# Altium project PCB_HAT.PrjPcb
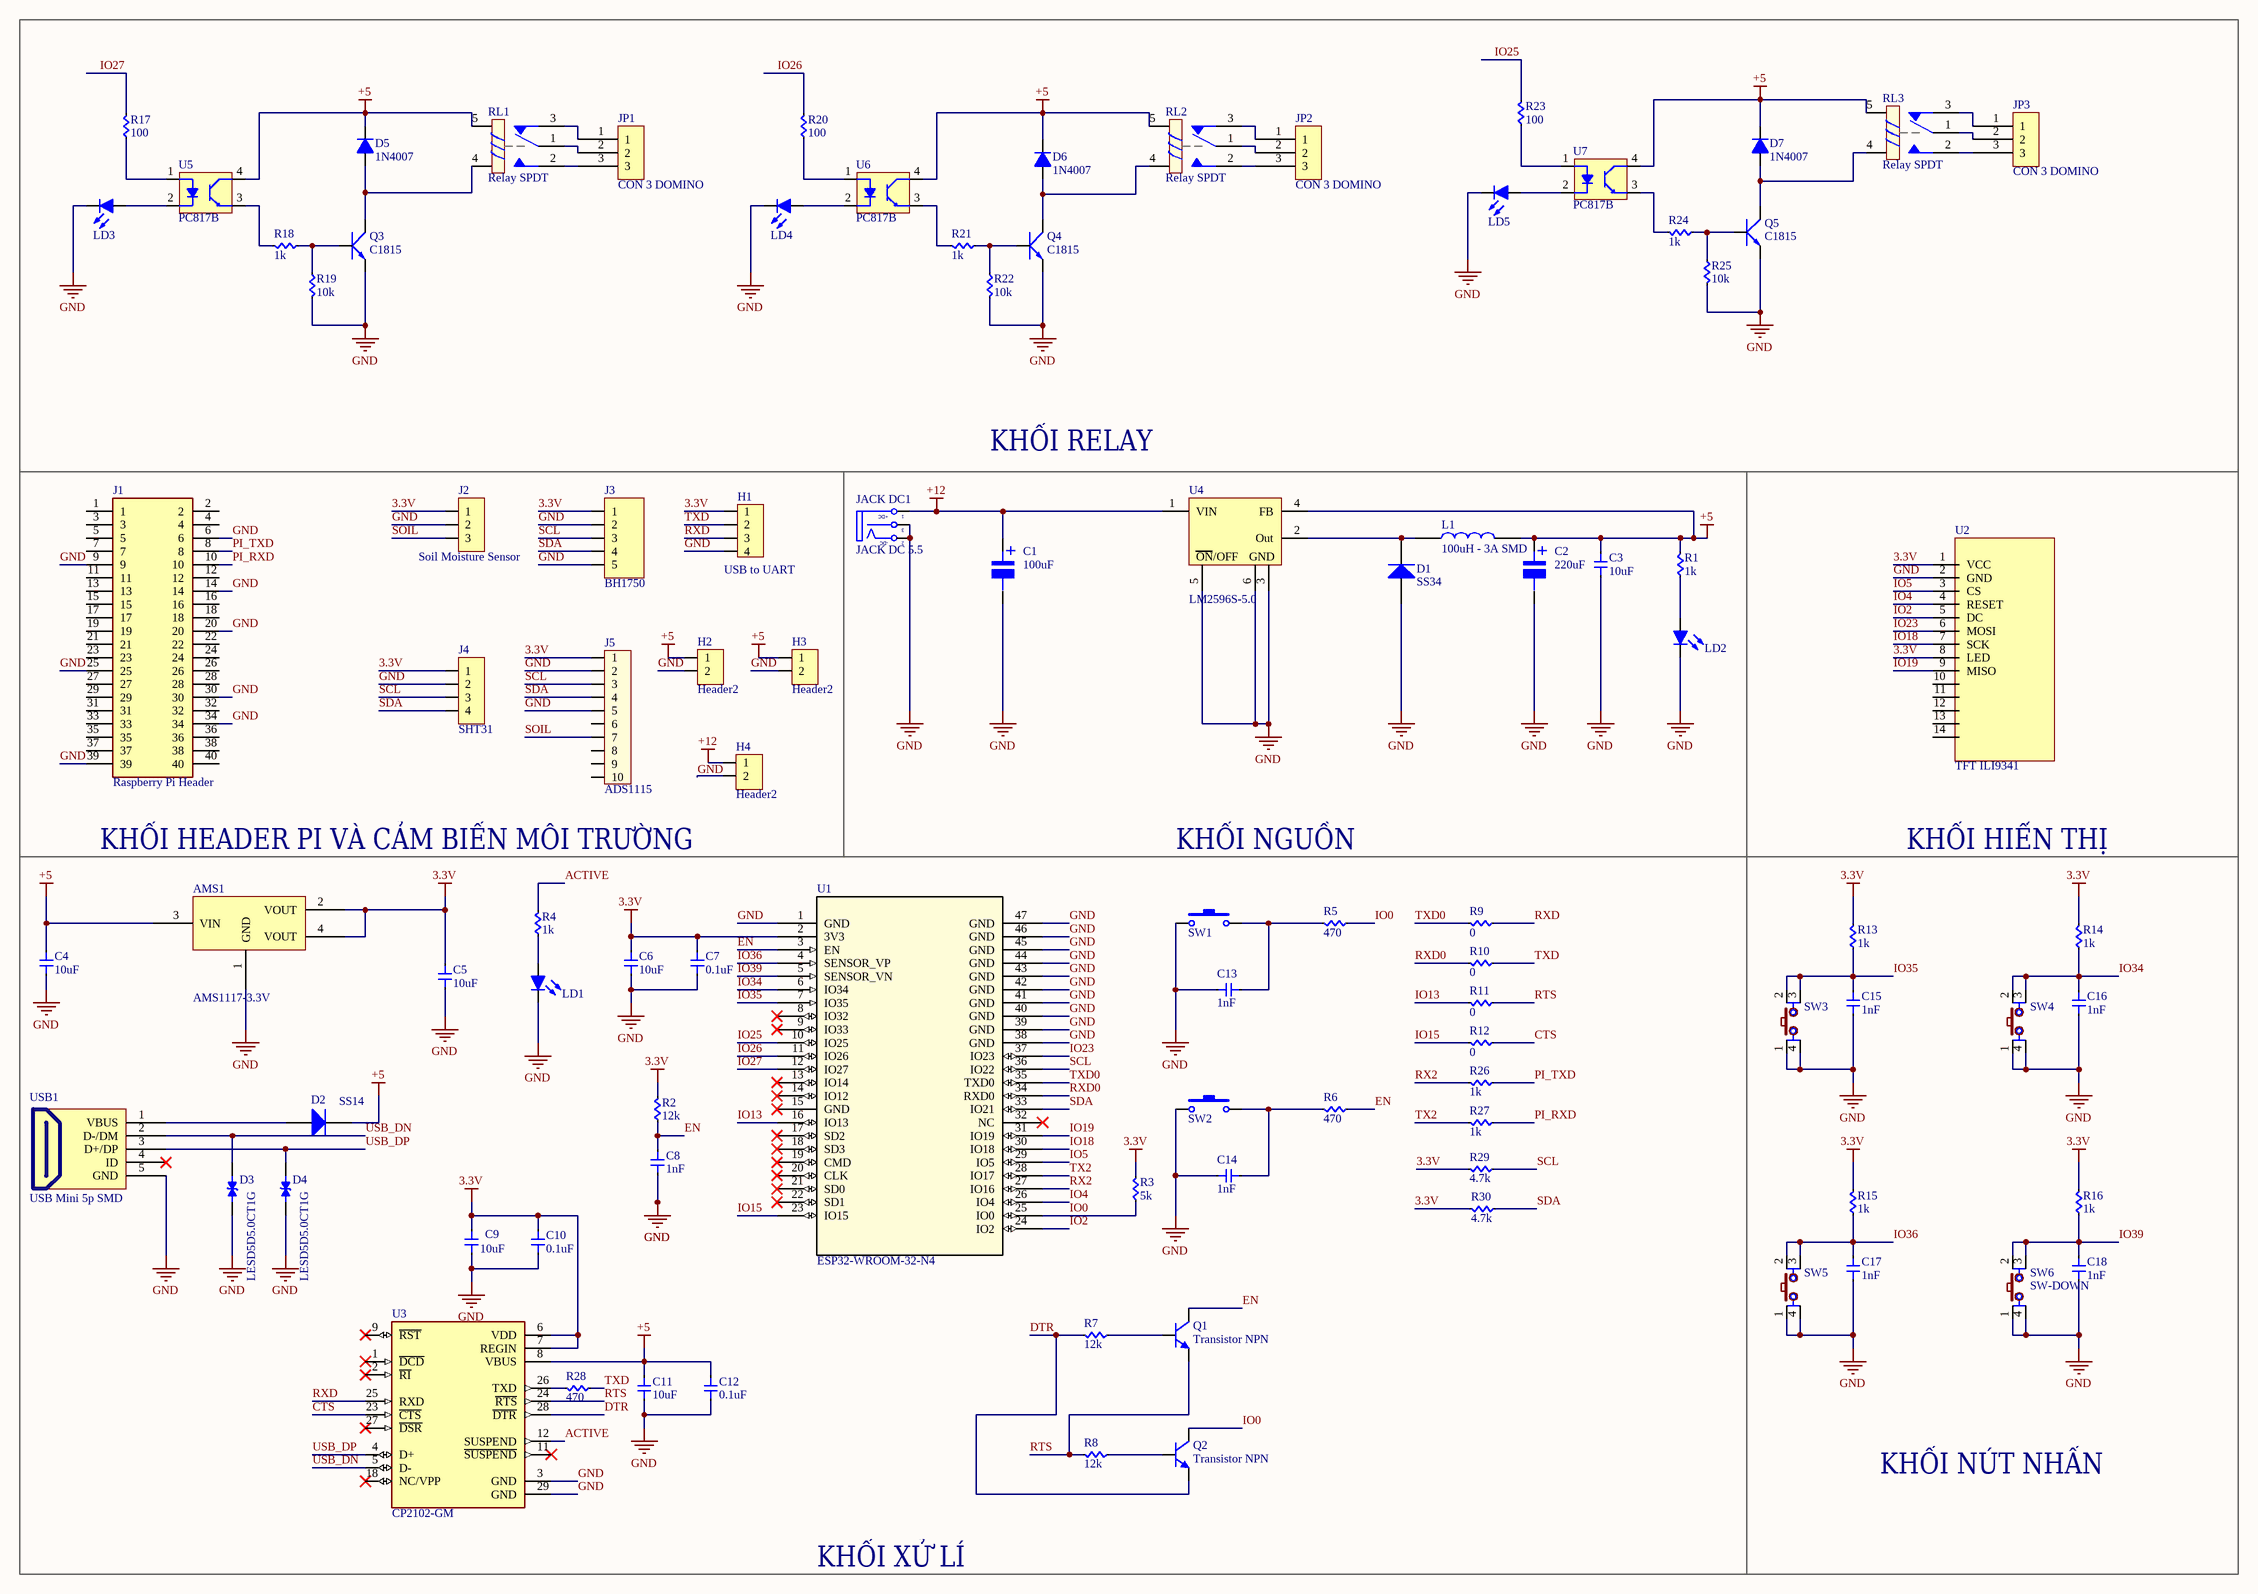
[diagram p0: Sheet2.SchDoc]
1 sheet, 97 parts. Net scope: global (net labels, ports and power ports of the same name join across sheets).
Board file: PCB3.PcbDoc

## Sheet Sheet2.SchDoc
size A2; SheetNumber: 1; SheetTotal: 1

### Parts
AMS1  AMS1117-3.3V  [SOT223]
C1  100uF  [tu nhom 6.3 (d)]
C2  220uF  [tu nhom 8 (e)]
C3  10uF  [Cap 0603]
C4  10uF  [Cap 0603]
C5  10uF  [Cap 0603]
C6  10uF  [Cap 0603]
C7  0.1uF  [Cap 0603]
C8  1nF  [Cap 0603]
C9  10uF  [Cap 0603]
C10  0.1uF  [Cap 0603]
C11  10uF  [Cap 0603]
C12  0.1uF  [Cap 0603]
C13  1nF  [Cap 0603]
C14  1nF  [Cap 0603]
C15  1nF  [Cap 0603]
C16  1nF  [Cap 0603]
C17  1nF  [Cap 0603]
C18  1nF  [Cap 0603]
D1  SS34  [DIODE SMA]
D2  SS14  [DIODE SMA]
D3  LESD5D5.0CT1G  [TVS_LESD5D5.0CT1G]
D4  LESD5D5.0CT1G  [TVS_LESD5D5.0CT1G]
D5  1N4007  [DIODE 1A]
D6  1N4007  [DIODE 1A]
D7  1N4007  [DIODE 1A]
H1  USB to UART  [HDR4]
H2  Header2  [HDR2]
H3  Header2  [HDR2]
H4  Header2  [HDR2]
J1  Raspberry Pi Header  [SAMESKY_SSK04-FPH-254-B20]
J2  Soil Moisture Sensor  [JP3-C1T]
J3  BH1750  [JP5-C1T]
J4  SHT31  [JP4-C1T]
J5  ADS1115  [CON10]
JACK_DC1  JACK DC 5.5  [JACK DC 5.5]
JP1  CON 3 DOMINO  [CON 3]
JP2  CON 3 DOMINO  [CON 3]
JP3  CON 3 DOMINO  [CON 3]
L1  100uH - 3A SMD  [Cuon Cam 12x12x10]
LD1  Led  [Led 0805]  (value not drawn)
LD2  Led  [Led 0805]  (value not drawn)
LD3  Led  [Led 0805]  (value not drawn)
LD4  Led  [Led 0805]  (value not drawn)
LD5  Led  [Led 0805]  (value not drawn)
Q1  Transistor NPN  [SOT-23]
Q2  Transistor NPN  [SOT-23]
Q3  C1815  [TO92-123]
Q4  C1815  [TO92-123]
Q5  C1815  [TO92-123]
R1  1k  [RES 0603]
R2  12k  [RES 0603]
R3  5k  [RES 0603]
R4  1k  [RES 0603]
R5  470  [RES 0603]
R6  470  [RES 0603]
R7  12k  [RES 0603]
R8  12k  [RES 0603]
R9  0  [RES 0603]
R10  0  [RES 0603]
R11  0  [RES 0603]
R12  0  [RES 0603]
R13  1k  [RES 0603]
R14  1k  [RES 0603]
R15  1k  [RES 0603]
R16  1k  [RES 0603]
R17  100  [RES 0603]
R18  1k  [RES 0603]
R19  10k  [RES 0603]
R20  100  [RES 0603]
R21  1k  [RES 0603]
R22  10k  [RES 0603]
R23  100  [RES 0603]
R24  1k  [RES 0603]
R25  10k  [RES 0603]
R26  1k  [RES 0603]
R27  1k  [RES 0603]
R28  470  [RES 0603]
R29  4.7k  [RES 0603]
R30  4.7k  [RES 0603]
RL1  Relay SPDT  [RL_SPDT_10A]
RL2  Relay SPDT  [RL_SPDT_10A]
RL3  Relay SPDT  [RL_SPDT_10A]
SW1  Nut Nhan 2 Chan SMD 3x6x2.5  [Nut Nhan 2 Chan SMD 3x6x2.5]  (value not drawn)
SW2  Nut Nhan 2 Chan SMD 3x6x2.5  [Nut Nhan 2 Chan SMD 3x6x2.5]  (value not drawn)
SW3  SW_CAPTURE  [SW2-DIP]  (value not drawn)
SW4  SW_UP  [SW2-DIP]  (value not drawn)
SW5  SW-OK  [SW2-DIP]  (value not drawn)
SW6  SW-DOWN  [SW2-DIP]
U1  ESP32-WROOM-32-N4  [MOD_ESP32-WROOM-32_EXP]
U2  TFT ILI9341  [TFT ILI9341]
U3  CP2102-GM  [QFN50P500X500X100-29N]
U4  LM2596S-5.0  [TO-263-5]
U5  PC817B  [DIP 4]
U6  PC817B  [DIP 4]
U7  PC817B  [DIP 4]
USB1  USB Mini 5p SMD  [USB Mini 5p SMD]

### Blocks framed on the sheet
KHỐI RELAY: D5-D7 JP1-JP3 LD3-LD5 Q3-Q5 R17-R25 RL1-RL3 U5-U7
KHỐI HEADER PI VÀ CẢM BIẾN MÔI TRƯỜNG: H1-H4 J1-J5
KHỐI HIỂN THỊ: U2
KHỐI NÚT NHẤN: C15-C18 R13-R16 SW3-SW6

### Nets
3.3V: AMS1.2(VOUT) AMS1.4(VOUT) C5.1 C6.1 C7.1 C9.1 C10.1 H1.1 J2.1 J3.1 J4.1 J5.1 R2.2 R3.2 R13.2 R14.2 R15.2 R16.2 R29.2 R30.2 U1.2(3V3) U2.1(VCC) U2.8(LED) U3.6(VDD) U3.7(REGIN)
+5: AMS1.3(VIN) C2.1 C3.1 C4.1 C11.1 C12.1 D2.2(K) D5.2(K) D6.2(K) D7.2(K) H2.1 H3.1 L1.2 R1.2 RL1.5(COIL2) RL2.5(COIL2) RL3.5(COIL2) U3.8(VBUS) U4.4(FB) U5.4(C) U6.4(C) U7.4(C)
+12: C1.1 H4.1 JACK_DC1.1(T) U4.1(VIN)
GND: AMS1.1(GND) C1.2 C2.2 C3.2 C4.2 C5.2 C6.2 C7.2 C8.2 C9.2 C10.2 C11.2 C12.2 C13.1 C14.1 C15.2 C16.2 C17.2 C18.2 D1.1(A) D3.1 D4.1 H1.4 H2.2 H3.2 H4.2 J1.6 J1.9 J1.14 J1.20 J1.25 J1.30 J1.34 J1.39 J2.2 J3.2 J3.5 J4.2 J5.2 J5.5 JACK_DC1.2(TN) JACK_DC1.3(S) LD1.2(K) LD2.2(K) LD3.2(K) LD4.2(K) LD5.2(K) Q3.1(E) Q4.1(E) Q5.1(E) R19.2 R22.2 R25.2 SW1.1 SW2.1 SW3.1 SW3.4 SW4.1 SW4.4 SW5.1 SW5.4 SW6.1 SW6.4 U1.1(GND) U1.38(GND) U1.39(GND) U1.40(GND) U1.41(GND) U1.42(GND) U1.43(GND) U1.44(GND) U1.45(GND) U1.46(GND) U1.47(GND) U2.2(GND) U3.3(GND) U3.29(GND) U4.3(GND) U4.5(~{ON}/OFF) U4.6(PAD) USB1.5(GND)
ACTIVE: R4.2 U3.12(SUSPEND)
CTS: R12.1 U3.23(~{CTS})
DTR: Q2.2(E) R7.2 U3.28(~{DTR})
EN: C8.1 Q1.3(C) R2.1 R6.1 U1.3(EN)
IO0: Q2.3(C) R3.1 R5.1 U1.25(IO0)
IO2: U1.24(IO2) U2.5(DC)
IO4: U1.26(IO4) U2.4(RESET)
IO5: U1.29(IO5) U2.3(CS)
IO13: R11.2 U1.16(IO13)
IO15: R12.2 U1.23(IO15)
IO18: U1.30(IO18) U2.7(SCK)
IO19: U1.31(IO19) U2.9(MISO)
IO23: U1.37(IO23) U2.6(MOSI)
IO25: R23.2 U1.10(IO25)
IO26: R20.2 U1.11(IO26)
IO27: R17.2 U1.12(IO27)
IO34: C16.1 R14.1 SW4.2 SW4.3 U1.6(IO34)
IO35: C15.1 R13.1 SW3.2 SW3.3 U1.7(IO35)
IO36: C17.1 R15.1 SW5.2 SW5.3 U1.4(SENSOR_VP)
IO39: C18.1 R16.1 SW6.2 SW6.3 U1.5(SENSOR_VN)
PI_RXD: J1.10 R27.1
PI_TXD: J1.8 R26.1
RTS: Q1.2(E) R8.2 R11.1 U3.24(~{RTS})
RX2: R26.2 U1.27(IO16)
RXD: H1.3 R9.1 U3.25(RXD)
RXD0: R10.2 U1.34(RXD0)
SCL: J3.3 J4.3 J5.3 R29.1 U1.36(IO22)
SDA: J3.4 J4.4 J5.4 R30.1 U1.33(IO21)
SOIL: J2.3 J5.7
TX2: R27.2 U1.28(IO17)
TXD: H1.2 R10.1 R28.1
TXD0: R9.2 U1.35(TXD0)
USB_DN: D3.2 U3.5(D-) USB1.2(D-/DM)
USB_DP: D4.2 U3.4(D+) USB1.3(D+/DP)
NetC13_2: C13.2 R5.2 SW1.2
NetC14_2: C14.2 R6.2 SW2.2
NetD1_2: D1.2(K) L1.1 U4.2(Out)
NetD2_1: D2.1(A) USB1.1(VBUS)
NetD5_1: D5.1(A) Q3.3(C) RL1.4(COIL1)
NetD6_1: D6.1(A) Q4.3(C) RL2.4(COIL1)
NetD7_1: D7.1(A) Q5.3(C) RL3.4(COIL1)
NetJP1_1: JP1.1 RL1.3(NC)
NetJP1_2: JP1.2 RL1.1(COM)
NetJP1_3: JP1.3 RL1.2(NO)
NetJP2_1: JP2.1 RL2.3(NC)
NetJP2_2: JP2.2 RL2.1(COM)
NetJP2_3: JP2.3 RL2.2(NO)
NetJP3_1: JP3.1 RL3.3(NC)
NetJP3_2: JP3.2 RL3.1(COM)
NetJP3_3: JP3.3 RL3.2(NO)
NetLD1_1: LD1.1(A) R4.1
NetLD2_1: LD2.1(A) R1.1
NetLD3_1: LD3.1(A) U5.2(K)
NetLD4_1: LD4.1(A) U6.2(K)
NetLD5_1: LD5.1(A) U7.2(K)
NetQ1_1: Q1.1(B) R7.1
NetQ2_1: Q2.1(B) R8.1
NetQ3_2: Q3.2(B) R18.1 R19.1
NetQ4_2: Q4.2(B) R21.1 R22.1
NetQ5_2: Q5.2(B) R24.1 R25.1
NetR17_1: R17.1 U5.1(A)
NetR18_2: R18.2 U5.3(E)
NetR20_1: R20.1 U6.1(A)
NetR21_2: R21.2 U6.3(E)
NetR23_1: R23.1 U7.1(A)
NetR24_2: R24.2 U7.3(E)
NetR28_2: R28.2 U3.26(TXD)

Not connected (* = marked no-connect by the designer): J1 1 2 3 4 5 7 11 12 13 15 16 17 18 19 21 22 23 24 26 27 28 29 31 32 33 35 36 37 38 40; J5 6 8 9 10; U1 8(IO32)* 9(IO33)* 13(IO14)* 14(IO12)* 15(GND)* 17(SD2)* 18(SD3)* 19(CMD)* 20(CLK)* 21(SD0)* 22(SD1)* 32(NC)*; U2 10(DB11) 11(DB12) 12(DB13) 13(DS14) 14(DB15); U3 1(~{DCD})* 2(~{RI})* 9(~{RST})* 11(~{SUSPEND})* 18(NC/VPP)* 27(~{DSR})*; USB1 4(ID)*

### Notes on the sheet
- KHỐI NGUỒN
- KHỐI XỬ LÍ
- (in symbol JACK DC 5.5) +DC; -DC
- (in symbol LM2596S-5.0) ON/OFF
- (in symbol Tu Nhom 100uF 16V) +
- (in symbol Tu Nhom 220uF 10V) +

### Library data of the parts
AMS1 = AMS1117 SMD: Dán; Value: AMS1117-3.3V SOT223; Don_Vi: Con; Ma_Hang: MH000596; Ghi_Chu: *; Kieu_Chan: *; Chung_Loai: Dán
C1 = Tu Nhom 100uF 16V: Dán; Don_Vi: Con; So_Chan: 2; Ten_Linh_Kien: Tụ Nhôm 100uF 16V 6.3x5.4MM; Ma_Hang: MH002219; Chung_Loai: Dán; Kieu_Chan: *
C2 = Tu Nhom 220uF 10V: Dán; So_Chan: 2; Ten_Linh_Kien: Tụ Nhôm 220uF 10V; Ma_Hang: MH004021; Don_Vi: Con; Chung_Loai: Dán; Kieu_Chan: *
C3-C18 = Cap 0603: Capacitor SMD 0603
D1 = Diode SS34 ( 1N5822 ): Dán; Don_Vi: Con; Ma_Hang: MH002104; Ten_Linh_Kien: Diode SS34 3A 40V SMA ( 1N5822 SS34A); Kieu_Chan: *; Chung_Loai: Dán
D2 = Diode SS14 ( 1N5819): Dán; Ma_Hang: MH002211; Don_Vi: Con; Ten_Linh_Kien: Diode SS14 DO214 Schottky 1A 40V ( 1N5819 DO214); Chung_Loai: Dán; Ghi_Chu: *; Kieu_Chan: *
D3 D4 = LESD5D5.0CT1G: Transient Voltage Suppressors for ESD Protection; MF: Leshan Radio Co.; Check_prices: https://www.snapeda.com/parts/LESD5D5.0CT1G/Leshan+Radio+Co./view-part/?ref=eda; Value: *; Availability: Not in stock; Package: None; SnapEDA_Link: https://www.snapeda.com/parts/LESD5D5.0CT1G/Leshan+Radio+Co./view-part/?ref=snap; MP: LESD5D5.0CT1G; Price: None
D5-D7 = Diode 1N4007: Cắm; Ten_Linh_Kien: Diode 1N4007 1A (DIP); Don_Vi: Con; Ma_Hang: MH001063; Ghi Chu: *; Kieu_Chan: *; Chung_Loai: Cắm
H1 = Header4: Header IDC, 4 x 1 Pin Vertical 2.54mm Pitch (Non-Boxed, Male); Manufacturer: W¨¹rth Elektronik eiSos GmbH; partNo: 613002143121; ComponentLink1 Description: Manufacturer; ComponentLink2 Description: Datasheet; NoPins: 02; Created Date: 29 March 2013; ComponentLink1URL: http://www.we-online.com; ComponentLink2URL: http://katalog.we-online.de/em/datasheet/6130xx143121.pdf; Created by: Karrer Zheng
H2-H4 = Header2: Header IDC, 2 x 1 Pin Vertical 2.54mm Pitch (Non-Boxed, Male); Manufacturer: W¨¹rth Elektronik eiSos GmbH; partNo: 613002143121; ComponentLink1 Description: Manufacturer; ComponentLink2 Description: Datasheet; NoPins: 02; Created Date: 29 March 2013; ComponentLink1URL: http://www.we-online.com; ComponentLink2URL: http://katalog.we-online.de/em/datasheet/6130xx143121.pdf; Created by: Karrer Zheng
J1 = SSK04-FPH-254-B20: 40 Position Header Connector 0.100 (2.54mm) Through Hole Gold; MF: Same Sky (Formerly CUI Devices); SnapEDA_Link: https://www.snapeda.com/parts/SSK04-FPH-254-B20/Same+Sky/view-part/?ref=snap; Package: None; Value: *; MP: SSK04-FPH-254-B20; Check_prices: https://www.snapeda.com/parts/SSK04-FPH-254-B20/Same+Sky/view-part/?ref=eda
J2 = JP3: WR-PHD 2.54 mm Angled Socket Header; Manufacturer: W¨¹rth Elektronik eiSos GmbH; partNo: 613003143121; ComponentLink1 Description: Manufacturer; ComponentLink2 Description: Datasheet; NoPins: 03; Created Date: 29 March 2013; ComponentLink1URL: http://www.we-online.com; ComponentLink2URL: http://katalog.we-online.de/em/datasheet/6130xx143121.pdf; Created by: Karrer Zheng
J3 = JP5: WR-PHD 2.54 mm Angled Socket Header; Manufacturer: W¨¹rth Elektronik eiSos GmbH; partNo: 613005143121; ComponentLink1 Description: Manufacturer; ComponentLink2 Description: Datasheet; NoPins: 05; Created Date: 29 March 2013; ComponentLink1URL: http://www.we-online.com; ComponentLink2URL: http://katalog.we-online.de/em/datasheet/6130xx143121.pdf; Created by: Karrer Zheng
J4 = JP4: WR-PHD 2.54 mm Angled Socket Header; Manufacturer: W¨¹rth Elektronik eiSos GmbH; partNo: 613004143121; ComponentLink1 Description: Manufacturer; ComponentLink2 Description: Datasheet; NoPins: 04; Created Date: 29 March 2013; ComponentLink1URL: http://www.we-online.com; ComponentLink2URL: http://katalog.we-online.de/em/datasheet/6130xx143121.pdf; Created by: Karrer Zheng
J5 = Con10: Connector 10; Value: Connector 10
JACK_DC1 = JACK DC 5.5: Value: Jac DC
L1 = CUON CAM 100uH SMD: Dán; Don_Vi: Con; Ma_Hang: MH003999; Ten_Linh_Kien: Cuộn Cảm 100uH 7x7x4MM CD74; Ma_Hang: *; Kieu_Chan: *; Chung_Loai: Dán
LD1-LD5 = Led: Typical LED
Q1 Q2 = Transistor NPN: NPN Bipolar Transistor
Q3-Q5 = 2N222: NPN 600mW, ECB; Value: C1815
R1-R18 R20 R21 R23 R24 R26-R30 = RES 0603: RES SMD 0603; Manufacturer: Vishay Dale; Manufacturer Part Number: CRCW040210K0FKED; Resistance (Ohms): 10k; Tolerance: ±1%; Power (Watts): 0.063W, 1/16W; Temperature Coefficient: ±100ppm/°C; Supplier 1: Digi-Key; RoHS: RoHS Compliant; Category: Resistors; Stock 1: 2392462; Pricing 1: 10=0.083, 50=0.0444, 200=0.0255, 1000=0.0174 (USD); Packaging: Cut Tape (CT); Composition: Thick Film; Features: Automotive AEC-Q200; Operating Temperature: -55°C ~ 155°C; Package / Case: 0402 (1005 Metric); Supplier Device Package: 0402 (1005 Metric); Size / Dimension: 0.039" L x 0.020" W (1.00mm x 0.50mm); Height: 0.016" (0.40mm); Number of Terminations: 2; ComponentLink1URL: http://www.vishay.com/docs/20035/dcrcwe3.pdf; ComponentLink1Description: http://www.vishay.com/docs/20035/dcrcwe3.pdf; Supplier Part Number 1: 541-10.0KLCT-ND
R19 R22 R25 = RES 0603: RES SMD 0603; Manufacturer: Vishay Dale; Manufacturer Part Number: CRCW040210K0FKED; Tolerance: ±1%; Power (Watts): 0.063W, 1/16W; Temperature Coefficient: ±100ppm/°C; Supplier 1: Digi-Key; RoHS: RoHS Compliant; Category: Resistors; Stock 1: 2392462; Pricing 1: 10=0.083, 50=0.0444, 200=0.0255, 1000=0.0174 (USD); Packaging: Cut Tape (CT); Resistance (Ohms): 10k; Composition: Thick Film; Features: Automotive AEC-Q200; Operating Temperature: -55°C ~ 155°C; Package / Case: 0402 (1005 Metric); Supplier Device Package: 0402 (1005 Metric); Size / Dimension: 0.039" L x 0.020" W (1.00mm x 0.50mm); Height: 0.016" (0.40mm); Number of Terminations: 2; ComponentLink1URL: http://www.vishay.com/docs/20035/dcrcwe3.pdf; ComponentLink1Description: http://www.vishay.com/docs/20035/dcrcwe3.pdf; Supplier Part Number 1: 541-10.0KLCT-ND
SW1 SW2 = Nut Nhan 2 Chan SMD 3x6x2.5: Ma_Hang: MH001036; Ten: Nút Nhấn 2 Chân 3x6x2.5MM SMD
SW3-SW6 = SW4: Switch button 4 pin; Value: Button chip 4 pin
U1 = ESP32-WROOM-32-N4: Description; Manufacturer_Name: Espressif Systems; Type: RF; Copyright: Copyright (C) 2025 Ultra Librarian. All rights reserved.; Manufacturer_Part_Number: ESP32-WROOM-32-N4; RefDes: RefDes
U3 = CP2102-GM: USB Bridge, USB to UART USB 2.0 UART Interface 28-QFN (5x5); MF: Silicon Labs; SnapEDA_Link: https://www.snapeda.com/parts/CP2102-GM/Silicon+Labs/view-part/?ref=snap; Package: QFN-28 Silicon Labs; Value: *; MP: CP2102-GM; Check_prices: https://www.snapeda.com/parts/CP2102-GM/Silicon+Labs/view-part/?ref=eda
U4 = LM2596S-5.0: Simple Switcher 3A Step-Down Voltage Regulator
U5-U7 = Opto PC817B
USB1 = USB Mini 5p SMD: USB Type B; Ten: MiniUSB 5P SMD; Ma_Hang: MH001022